# EAGLE schematic IV (EAGLE 8.1.0)
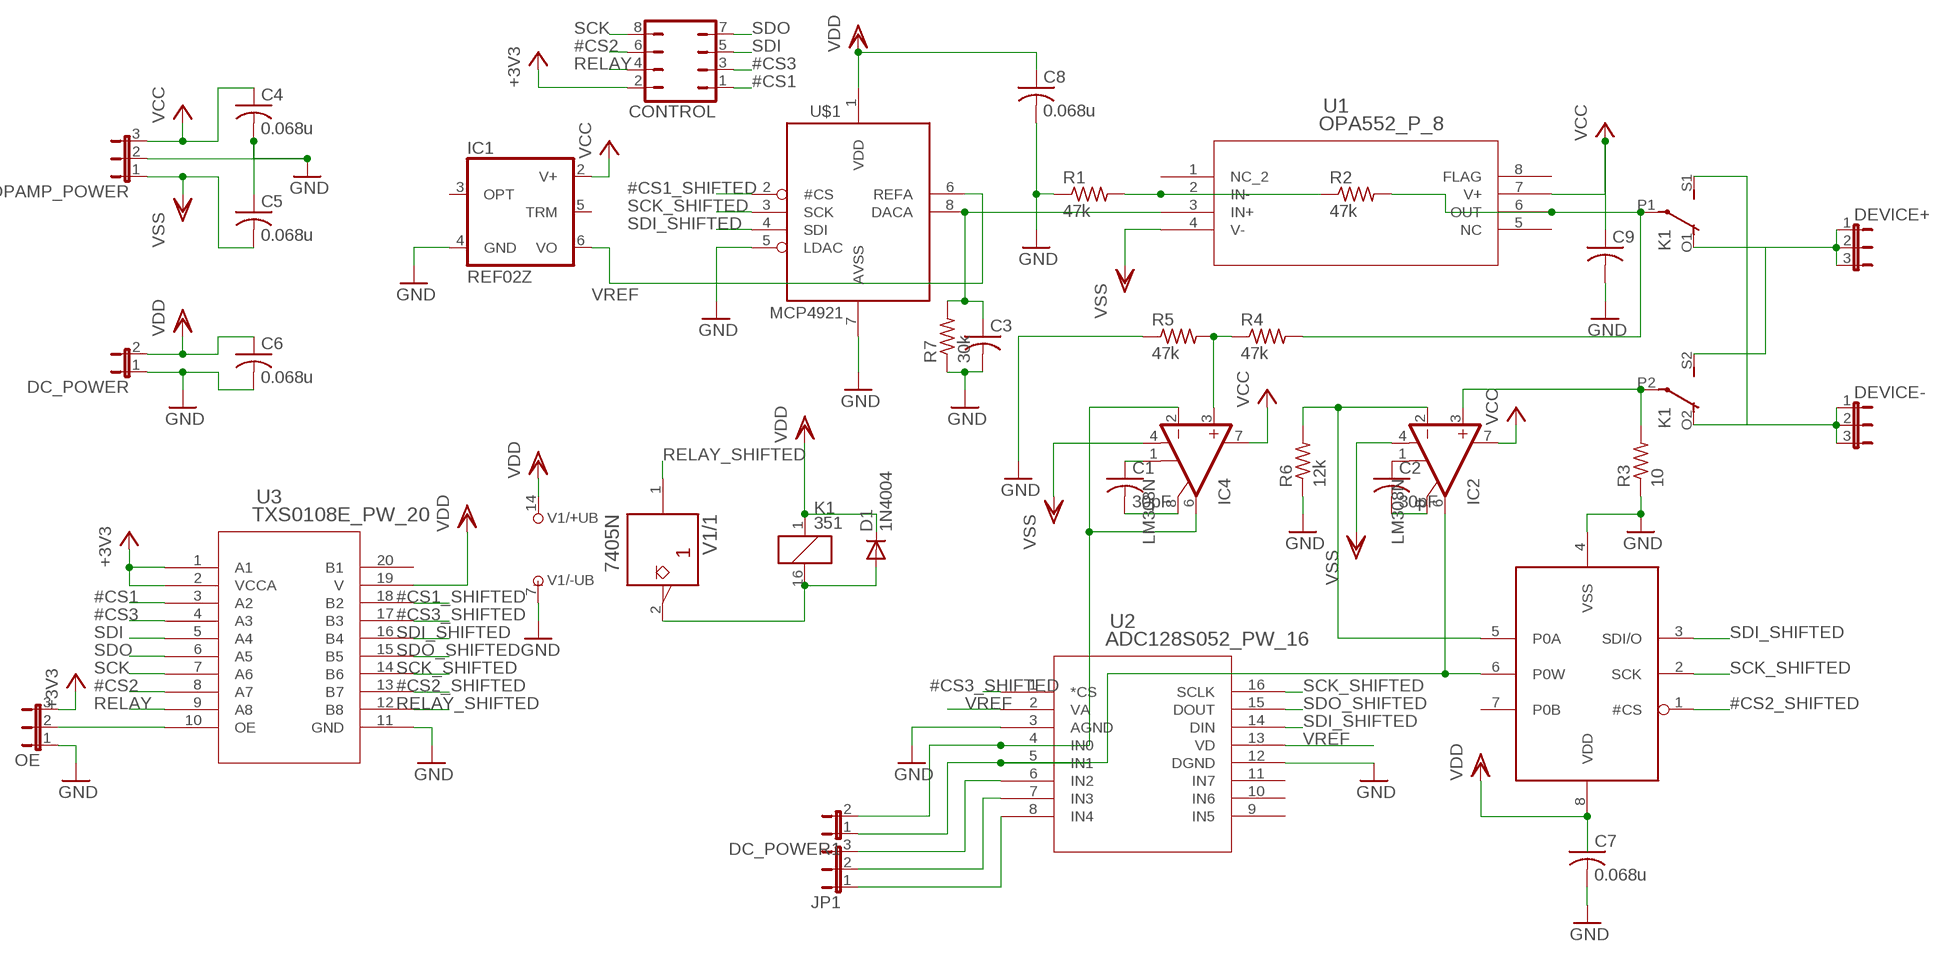
[diagram p0: schematic, sheet 1]

## Parts
C1  30pF  C-US050-035X075  [C050-035X075]
C2  30pF  C-US050-035X075  [C050-035X075]
C3  C-US050-035X075  [C050-035X075]
C4  0.068u  C-US050-035X075  [C050-035X075]
C5  0.068u  C-US050-035X075  [C050-035X075]
C6  0.068u  C-US050-035X075  [C050-035X075]
C7  0.068u  C-US050-035X075  [C050-035X075]
C8  0.068u  C-US050-035X075  [C050-035X075]
C9  C-US050-035X075  [C050-035X075]
CONTROL  JP4Q  [JP4Q]
D1  1N4004  [DO41-10]
DC_POWER  JP1E  [JP1]
DC_POWER1  JP1E  [JP1]
DEVICE+  JP2E  [JP2]
DEVICE-  JP2E  [JP2]
IC1  REF02Z  [DIL08]
IC2  LM308N  [DIL08]
IC4  LM308N  [DIL08]
JP1  JP2E  [JP2]
K1  351  [351]
OE  JP2E  [JP2]
OPAMP_POWER  JP2E  [JP2]
R1  47k  R-US_0207/10  [0207/10]
R2  47k  R-US_0207/10  [0207/10]
R3  10  R-US_0207/10  [0207/10]
R4  47k  R-US_0207/10  [0207/10]
R5  47k  R-US_0207/10  [0207/10]
R6  12k  R-US_0207/10  [0207/10]
R7  30k  R-US_0207/10  [0207/10]
U1  OPA552_P_8  [P8]
U2  ADC128S052_PW_16  [MTC16]
U3  TXS0108E_PW_20  [PW20]
U$1  MCP4921  [DIL08]
U$2  MCP4161  [DIL08]
V1  7405N  [DIL14]

## Nets
#CS1: CONTROL.1 U3.3(A2)
#CS1_SHIFTED: U3.18(B2) U$1.2(#CS)
#CS2: CONTROL.6 U3.8(A7)
#CS2_SHIFTED: U3.13(B7) U$2.1(#CS)
#CS3: CONTROL.3 U3.4(A3)
#CS3_SHIFTED: U2.1(*CS) U3.17(B3)
+3V3: CONTROL.2 OE.3 U3.1(A1) U3.2(VCCA)
GND: C3.2 C4.2 C5.1 C6.2 C7.2 C8.2 C9.2 DC_POWER.1 IC1.4(GND) OE.1 OPAMP_POWER.2 R1.1 R3.1 R5.1 R6.1 R7.1 U2.3(AGND) U2.12(DGND) U3.11(GND) U$1.5(LDAC) U$1.7(AVSS) U$2.4(VSS) V1.7(/-UB:-UB)
N$2: DC_POWER1.1 IC2.6(OUT) U2.5(IN1) U$2.6(P0W)
N$3: DC_POWER1.2 IC4.2(-IN) IC4.6(OUT) U2.4(IN0)
N$4: JP1.3 U2.6(IN2)
N$5: JP1.2 U2.7(IN3)
N$6: JP1.1 U2.8(IN4)
N$7: C3.1 R7.2 U1.3(IN+) U$1.8(DACA)
N$8: R1.2 R2.1 U1.2(IN-)
N$9: K1.P1(2:P) R2.2 R4.2 U1.6(OUT)
N$10: D1.A K1.16 V1.2(/1:Y)
N$12: IC2.3(+IN) K1.P2(3:P) R3.2
N$13: DEVICE+.1 DEVICE+.2 DEVICE+.3 K1.O1(2:O) K1.S2(3:S)
N$14: DEVICE-.1 DEVICE-.2 DEVICE-.3 K1.O2(3:O) K1.S1(2:S)
N$15: OE.2 U3.10(OE)
N$16: IC4.3(+IN) R4.1 R5.2
N$17: C1.1 IC4.1(CMP1)
N$18: IC2.2(-IN) R6.2 U$2.5(P0A)
N$19: C1.2 IC4.8(CMP2)
N$21: C2.1 IC2.1(CMP1)
N$22: C2.2 IC2.8(CMP2)
RELAY: CONTROL.4 U3.9(A8)
RELAY_SHIFTED: U3.12(B8) V1.1(/1:A)
SCK: CONTROL.8 U3.7(A6)
SCK_SHIFTED: U2.16(SCLK) U3.14(B6) U$1.3(SCK) U$2.2(SCK)
SDI: CONTROL.5 U3.5(A4)
SDI_SHIFTED: U2.14(DIN) U3.16(B4) U$1.4(SDI) U$2.3(SDI/O)
SDO: CONTROL.7 U3.6(A5)
SDO_SHIFTED: U2.15(DOUT) U3.15(B5)
VCC: C4.1 C9.1 IC1.2(V+) IC2.7(V+) IC4.7(V+) OPAMP_POWER.3 U1.7(V+)
VDD: C6.1 C7.1 C8.1 D1.C DC_POWER.2 K1.1 U3.19(V) U$1.1(VDD) U$2.8(VDD) V1.14(/+UB:+UB)
VREF: IC1.6(VO) U2.2(VA) U2.13(VD) U$1.6(REFA)
VSS: C5.2 IC2.4(V-) IC4.4(V-) OPAMP_POWER.1 U1.4(V-)
Unconnected: IC1.3(OPT) IC1.5(TRM) U1.1(NC_2) U1.5(NC) U1.8(FLAG) U2.9(IN5) U2.10(IN6) U2.11(IN7) U3.20(B1) U$2.7(P0B) V1.3(/2:A) V1.4(/2:Y) V1.5(/3:A) V1.6(/3:Y) V1.8(/4:Y) V1.9(/4:A) V1.10(/5:Y) V1.11(/5:A) V1.12(/6:Y) V1.13(/6:A)

## Library data of the parts
C1-C9 = resistor:C-US: CAPACITOR, American symbol
CONTROL = jumper:JP4Q: JUMPER
D1 = diode:1N4004: DIODE general purpose rectifier, 1 A
DC_POWER DC_POWER1 = jumper:JP1E: JUMPER
DEVICE+ DEVICE- JP1 OE OPAMP_POWER = jumper:JP2E: JUMPER
IC1 = linear:REF02: VOLTAGE REFERENCE
IC2 IC4 = linear:LM308: OP AMP
K1 = relay:351: RELAY 2 x switch, Omron; OC_FARNELL: unknown; OC_NEWARK: unknown
R1-R7 = resistor:R-US_: RESISTOR, American symbol
U1 = burr-brown:OPA552_P_8; DATASHEETURL: httpwww.ti.comlitgpnOPA552; FAMILY_NAME: HIGH OUTPUT CURRENT; GENERIC_PART_NUMBER: OPA552; INDUSTRY_STD_PKG_TYPE: PDIP; MANUFACTURER: Texas Instruments; MANUFACTURER_PART_NUMBER: opa552_p_8; PACKAGE_DESIGNATOR: P; PIN_COUNT: 8; VENDOR: Texas Instruments
U2 = texas:ADC128S052_PW_16; BASEPN: ADC128S052; DATASHEETURL: httpwww.ti.comlitdssymlinkadc128s052.pdf; MANUFACTURER: Texas Instruments; MANUFACTURER_PART_NUMBER: adc128s052_pw_16; NSC_PACKAGEREFERENCE: MTC16; VENDOR: Texas Instruments
U3 = texas:TXS0108E_PW_20; DATASHEETURL: httpwww.ti.comlitgpnTXS0108E; FAMILY_NAME: AUTO DIRECTION SENSING DUAL SUPPLY TRANSLATOR; GENERIC_PART_NUMBER: TXS0108E; INDUSTRY_STD_PKG_TYPE: TSSOP; MANUFACTURER: Texas Instruments; MANUFACTURER_PART_NUMBER: txs0108e_pw_20; PACKAGE_DESIGNATOR: PW; PIN_COUNT: 20; VENDOR: Texas Instruments
U$1 = adafruit:MCP4921
U$2 = adafruit:MCP4161
V1 = 74ttl-din:74*05: Hex INVERTER, open collector

## Net classes
0 default: width 0.406 mm, drill 0.406 mm, clearance 0.254 mm